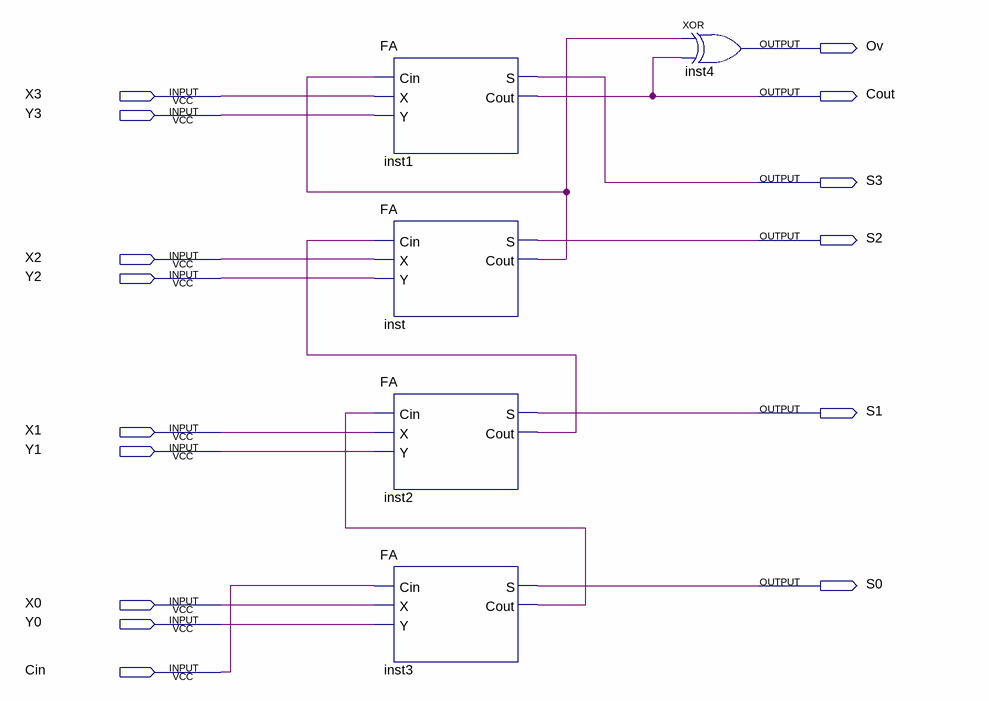
[diagram p0: schematic sheet]
// Quartus schematic adder_4bit.bdf as structural Verilog: 5 symbols, 15 pins
module adder_4bit (
  input  X3,
  input  Y3,
  input  X2,
  input  Y2,
  input  X1,
  input  Y1,
  input  X0,
  input  Y0,
  input  Cin,
  output Ov,
  output Cout,
  output S3,
  output S2,
  output S1,
  output S0
);

  wire inst2_cout, inst3_cout, inst_cout;

  FA inst1 (.Cin(inst_cout), .X(X3), .Y(Y3), .S(S3), .Cout(Cout));
  FA inst (.Cin(inst2_cout), .X(X2), .Y(Y2), .S(S2), .Cout(inst_cout));
  FA inst2 (.Cin(inst3_cout), .X(X1), .Y(Y1), .S(S1), .Cout(inst2_cout));
  FA inst3 (.Cin(Cin), .X(X0), .Y(Y0), .S(S0), .Cout(inst3_cout));
  xor inst4 (Ov, inst_cout, Cout);
endmodule
